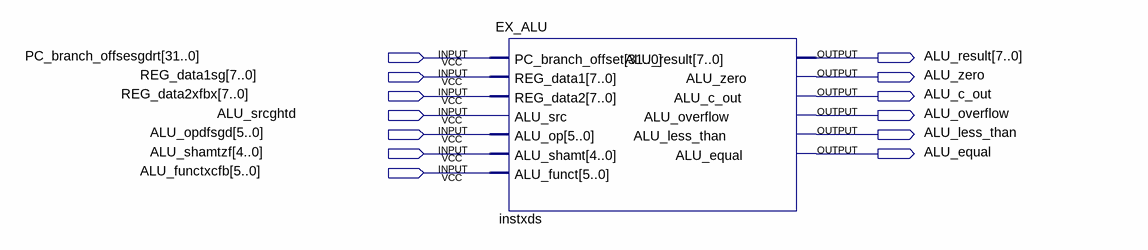
[diagram p0: schematic sheet]
// Quartus schematic component_test.bdf as structural Verilog: 1 symbols, 13 pins
module component_test (
  input  [31:0] PC_branch_offsesgdrt,
  input  [7:0] REG_data1sg,
  input  [7:0] REG_data2xfbx,
  input  ALU_srcghtd,
  input  [5:0] ALU_opdfsgd,
  input  [4:0] ALU_shamtzf,
  input  [5:0] ALU_functxcfb,
  output [7:0] ALU_result,
  output ALU_zero,
  output ALU_c_out,
  output ALU_overflow,
  output ALU_less_than,
  output ALU_equal
);

  EX_ALU instxds (
    .PC_branch_offset(PC_branch_offsesgdrt), .REG_data1(REG_data1sg), .REG_data2(REG_data2xfbx),
    .ALU_src(ALU_srcghtd), .ALU_op(ALU_opdfsgd), .ALU_shamt(ALU_shamtzf), .ALU_funct(ALU_functxcfb),
    .ALU_result(ALU_result), .ALU_zero(ALU_zero), .ALU_c_out(ALU_c_out), .ALU_overflow(ALU_overflow),
    .ALU_less_than(ALU_less_than), .ALU_equal(ALU_equal));
endmodule
